# Altium schematic sheet RS485.SchDoc
size A3
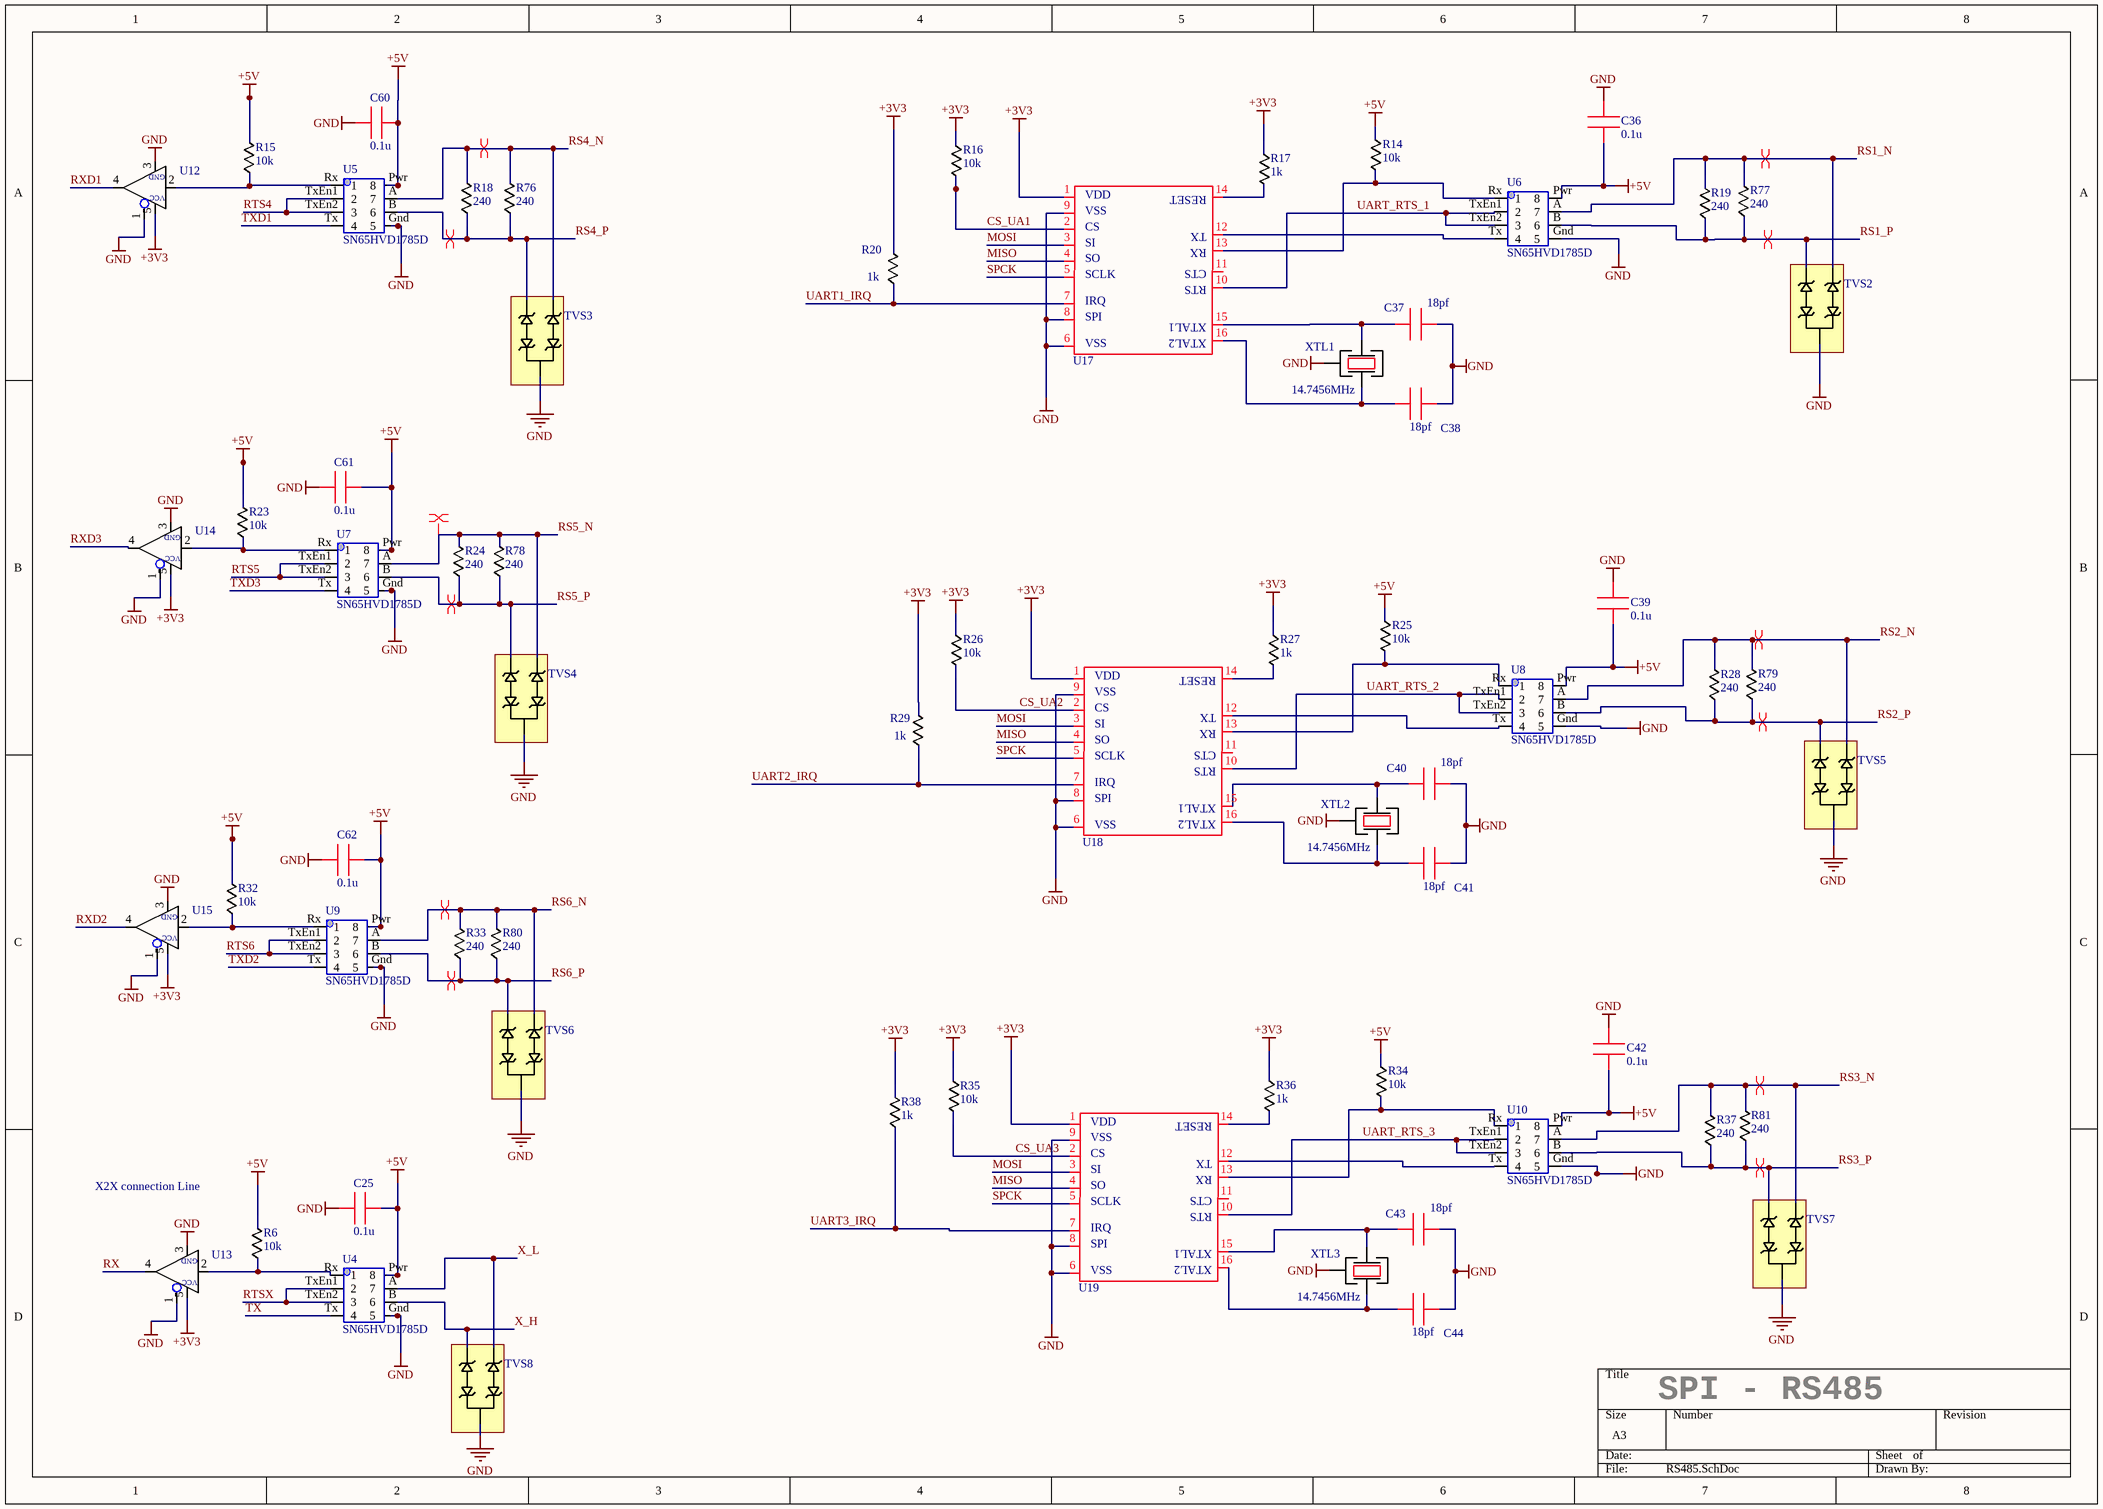
[diagram p0: RS485.SchDoc]

## Parts
C25  0.1u  [0603 CAP]
C36  0.1u  [0603 CAP]
C37  18pf  [0603 CAP]
C38  18pf  [0603 CAP]
C39  0.1u  [0603 CAP]
C40  18pf  [0603 CAP]
C41  18pf  [0603 CAP]
C42  0.1u  [0603 CAP]
C43  18pf  [0603 CAP]
C44  18pf  [0603 CAP]
C60  0.1u  [0603 CAP]
C61  0.1u  [0603 CAP]
C62  0.1u  [0603 CAP]
R6  10k  [0603 - RES]
R14  10k  [0603 - RES]
R15  10k  [0603 - RES]
R16  10k  [0603 - RES]
R17  1k  [0603 - RES]
R18  240  [0603 - RES]
R19  240  [0603 - RES]
R20  1k  [0603 - RES]
R23  10k  [0603 - RES]
R24  240  [0603 - RES]
R25  10k  [0603 - RES]
R26  10k  [0603 - RES]
R27  1k  [0603 - RES]
R28  240  [0603 - RES]
R29  1k  [0603 - RES]
R32  10k  [0603 - RES]
R33  240  [0603 - RES]
R34  10k  [0603 - RES]
R35  10k  [0603 - RES]
R36  1k  [0603 - RES]
R37  240  [0603 - RES]
R38  1k  [0603 - RES]
R76  240  [0603 - RES]
R77  240  [0603 - RES]
R78  240  [0603 - RES]
R79  240  [0603 - RES]
R80  240  [0603 - RES]
R81  240  [0603 - RES]
TVS2  CDSOT23-SM712  [Sot23-3]  (value not drawn)
TVS3  CDSOT23-SM712  [Sot23-3]  (value not drawn)
TVS4  CDSOT23-SM712  [Sot23-3]  (value not drawn)
TVS5  CDSOT23-SM712  [Sot23-3]  (value not drawn)
TVS6  CDSOT23-SM712  [Sot23-3]  (value not drawn)
TVS7  CDSOT23-SM712  [Sot23-3]  (value not drawn)
TVS8  CDSOT23-SM712  [Sot23-3]  (value not drawn)
U4  SN65HVD1785D  [MAX485 - duplicate]
U5  SN65HVD1785D  [MAX485 - duplicate]
U6  SN65HVD1785D  [MAX485 - duplicate]
U7  SN65HVD1785D  [MAX485 - duplicate]
U8  SN65HVD1785D  [MAX485 - duplicate]
U9  SN65HVD1785D  [MAX485 - duplicate]
U10  SN65HVD1785D  [MAX485 - duplicate]
U12  74LVC1G125DCK  [74LVC1G125DCK]  (value not drawn)
U13  74LVC1G125DCK  [74LVC1G125DCK]  (value not drawn)
U14  74LVC1G125DCK  [74LVC1G125DCK]  (value not drawn)
U15  74LVC1G125DCK  [74LVC1G125DCK]  (value not drawn)
U17  SC16IS740  [SC16IS740]  (value not drawn)
U18  SC16IS740  [SC16IS740]  (value not drawn)
U19  SC16IS740  [SC16IS740]  (value not drawn)
XTL1  14.7456MHz  [XTAL KX-7T]
XTL2  14.7456MHz  [XTAL KX-7T]
XTL3  14.7456MHz  [XTAL KX-7T]

## Nets
+3V3: R16.1 R17.1 R20.2 R26.1 R27.1 R29.2 R35.1 R36.1 R38.2 U12.5 U13.5 U14.5 U15.5 U17.1 U18.1 U19.1
+5V: C25.2 C36.2 C39.2 C42.2 C60.2 C61.2 C62.2 R6.2 R14.1 R15.2 R23.2 R25.1 R32.2 R34.1 U4.Pwr(8) U5.Pwr(8) U6.Pwr(8) U7.Pwr(8) U8.Pwr(8) U9.Pwr(8) U10.Pwr(8)
GND: C25.1 C36.1 C37.1 C38.1 C39.1 C40.1 C41.1 C42.1 C43.1 C44.1 C60.1 C61.1 C62.1 TVS2.3 TVS3.3 TVS4.3 TVS5.3 TVS6.3 TVS7.3 TVS8.3 U4.Gnd(5) U5.Gnd(5) U6.Gnd(5) U7.Gnd(5) U8.Gnd(5) U9.Gnd(5) U10.Gnd(5) U12.1 U12.3 U13.1 U13.3 U14.1 U14.3 U15.1 U15.3 U17.6 U17.8 U17.9 U18.6 U18.8 U18.9 U19.6 U19.8 U19.9 XTL1.2 XTL2.2 XTL3.2
CS_UA1: R16.2 U17.2
CS_UA2: R26.2 U18.2
CS_UA3: R35.2 U19.2
MISO: U17.4 U18.4 U19.4
MOSI: U17.3 U18.3 U19.3
RS1_N: R19.2 R77.2 TVS2.1 U6.A(7)
RS1_P: R19.1 R77.1 TVS2.2 U6.B(6)
RS2_N: R28.2 R79.2 TVS5.1 U8.A(7)
RS2_P: R28.1 R79.1 TVS5.2 U8.B(6)
RS3_N: R37.2 R81.2 TVS7.1 U10.A(7)
RS3_P: R37.1 R81.1 TVS7.2 U10.B(6)
RS4_N: R18.2 R76.2 TVS3.1 U5.A(7)
RS4_P: R18.1 R76.1 TVS3.2 U5.B(6)
RS5_N: R24.2 R78.2 TVS4.1 U7.A(7)
RS5_P: R24.1 R78.1 TVS4.2 U7.B(6)
RS6_N: R33.2 R80.2 TVS6.1 U9.A(7)
RS6_P: R33.1 R80.1 TVS6.2 U9.B(6)
RTS4: U5.TxEn1(2) U5.TxEn2(3)
RTS5: U7.TxEn1(2) U7.TxEn2(3)
RTS6: U9.TxEn1(2) U9.TxEn2(3)
RTSX: U4.TxEn1(2) U4.TxEn2(3)
RX: U13.4
RXD1: U12.4
RXD2: U15.4
RXD3: U14.4
SPCK: U17.5 U18.5 U19.5
TX: U4.Tx(4)
TXD1: U5.Tx(4)
TXD2: U9.Tx(4)
TXD3: U7.Tx(4)
UART1_IRQ: R20.1 U17.7
UART2_IRQ: R29.1 U18.7
UART3_IRQ: R38.1 U19.7
UART_RTS_1: U6.TxEn1(2) U6.TxEn2(3) U17.10
UART_RTS_2: U8.TxEn1(2) U8.TxEn2(3) U18.10
UART_RTS_3: U10.TxEn1(2) U10.TxEn2(3) U19.10
X_H: TVS8.2 U4.B(6)
X_L: TVS8.1 U4.A(7)
NetC37_2: C37.2 U17.15 XTL1.1
NetC38_2: C38.2 U17.16 XTL1.3
NetC40_2: C40.2 U18.15 XTL2.1
NetC41_2: C41.2 U18.16 XTL2.3
NetC43_2: C43.2 U19.15 XTL3.1
NetC44_2: C44.2 U19.16 XTL3.3
NetR6_1: R6.1 U4.Rx(1) U13.2
NetR14_2: R14.2 U6.Rx(1) U17.13
NetR15_1: R15.1 U5.Rx(1) U12.2
NetR17_2: R17.2 U17.14
NetR23_1: R23.1 U7.Rx(1) U14.2
NetR25_2: R25.2 U8.Rx(1) U18.13
NetR27_2: R27.2 U18.14
NetR32_1: R32.1 U9.Rx(1) U15.2
NetR34_2: R34.2 U10.Rx(1) U19.13
NetR36_2: R36.2 U19.14
NetU6_Tx: U6.Tx(4) U17.12
NetU8_Tx: U8.Tx(4) U18.12
NetU10_Tx: U10.Tx(4) U19.12

Not connected (* = marked no-connect by the designer): U17 11(8); U18 11(8); U19 11(8)

## Layout directives
differential pair: RS1_N, RS1_P, RS2_N, RS2_P, RS3_N, RS3_P, RS4_N, RS4_P, RS5_N, RS5_P, RS6_N, RS6_P

## Notes on the sheet
- X2X connection Line
- SPI - RS485
- (in symbol 74LVC1G125DCK) GND; VCC
- (in symbol SC16IS740) RESET; VDD; VSS; TX; CS; SI; RX; SO; CTS; SCLK; RTS; IRQ; SPI; XTAL1; XTAL2

## Library data of the parts
C25 C36 C39 C42 C60-C62 = Capasitor 0805
C37 C38 C40 C41 C43 C44 = Capasitor 0805: GRM1885C1H180JA01D
R6 R14 R15 R23 R25 R32 R34 = Resistor 0805: RC0603FR-078K2
R16 R17 R20 R26 R27 R29 R35 R36 R38 = Resistor 0805: RC0603JR-0710K
R18 R19 R24 R28 R33 R37 R76-R81 = Resistor 0805: RC0603JR-07120R
U4-U10 = MAX485
XTL1-XTL3 = KX-7: Geyer KX-7 14.7456MHz